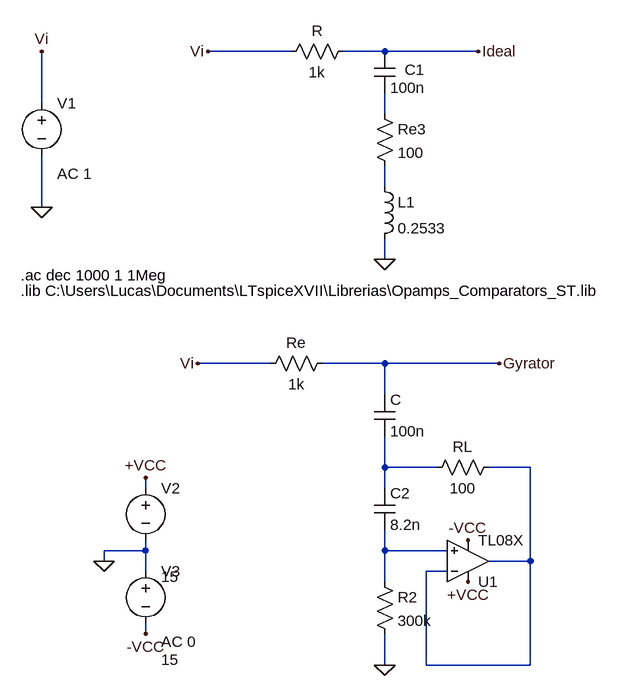
[diagram p0: schematic Rechazabanda.asc]
Rechazabanda.asc, the LTspice schematic file:
Version 4
SHEET 1 880 1108
WIRE 64 96 -64 96
WIRE 208 96 144 96
WIRE 352 96 208 96
WIRE -320 176 -320 96
WIRE 208 192 208 160
WIRE 208 304 208 272
WIRE -320 336 -320 256
WIRE 208 416 208 384
WIRE 32 576 -80 576
WIRE 208 576 112 576
WIRE 384 576 208 576
WIRE 208 624 208 576
WIRE 208 736 208 688
WIRE 288 736 208 736
WIRE 432 736 368 736
WIRE -160 768 -160 752
WIRE 208 768 208 736
WIRE -160 864 -160 848
WIRE -160 864 -224 864
WIRE 208 864 208 832
WIRE 304 864 208 864
WIRE -224 880 -224 864
WIRE 432 880 432 736
WIRE 432 880 368 880
WIRE -160 896 -160 864
WIRE 304 896 272 896
WIRE 208 912 208 864
WIRE -160 992 -160 976
WIRE 208 1040 208 992
WIRE 272 1040 272 896
WIRE 432 1040 432 880
WIRE 432 1040 272 1040
FLAG 208 416 0
FLAG 352 96 Ideal
FLAG -64 96 Vi
FLAG -320 96 Vi
FLAG -320 336 0
FLAG 208 1040 0
FLAG -80 576 Vi
FLAG 384 576 Gyrator
FLAG -224 880 0
FLAG -160 752 +VCC
FLAG -160 992 -VCC
FLAG 336 912 +VCC
FLAG 336 848 -VCC
SYMBOL res 160 80 R90
WINDOW 0 0 56 VBottom 2
WINDOW 3 32 56 VTop 2
SYMATTR InstName R
SYMATTR Value 1k
SYMBOL cap 192 96 R0
WINDOW 0 47 28 Left 2
SYMATTR InstName C1
SYMATTR Value 100n
SYMBOL res 192 176 R0
SYMATTR InstName Re3
SYMATTR Value 100
SYMBOL ind 192 288 R0
SYMATTR InstName L1
SYMATTR Value 0.2533
SYMBOL voltage -320 160 R0
WINDOW 123 24 124 Left 2
WINDOW 39 0 0 Left 0
SYMATTR Value2 AC 1
SYMATTR InstName V1
SYMATTR Value ""
SYMBOL res 128 560 R90
WINDOW 0 0 56 VBottom 2
WINDOW 3 32 56 VTop 2
SYMATTR InstName Re
SYMATTR Value 1k
SYMBOL cap 192 624 R0
SYMATTR InstName C
SYMATTR Value 100n
SYMBOL cap 192 768 R0
SYMATTR InstName C2
SYMATTR Value 8.2n
SYMBOL res 192 896 R0
SYMATTR InstName R2
SYMATTR Value 300k
SYMBOL Opamps\\opamp2 336 944 M180
SYMATTR InstName U1
SYMATTR Value TL08X
SYMBOL res 384 720 R90
WINDOW 0 0 56 VBottom 2
WINDOW 3 32 56 VTop 2
SYMATTR InstName RL
SYMATTR Value 100
SYMBOL voltage -160 752 R0
WINDOW 3 24 152 Left 2
WINDOW 123 24 124 Left 2
WINDOW 39 0 0 Left 0
SYMATTR Value 15
SYMATTR InstName V2
SYMBOL voltage -160 880 R0
WINDOW 3 24 152 Left 2
WINDOW 123 24 124 Left 2
WINDOW 39 0 0 Left 0
SYMATTR Value 15
SYMATTR Value2 AC 0
SYMATTR InstName V3
TEXT -352 440 Left 2 !.ac dec 1000 1 1Meg
TEXT -352 464 Left 2 !.lib C:\\Users\\Lucas\\Documents\\LTspiceXVII\\Librerias\\Opamps_Comparators_ST.lib

The netlist it stands for:
* Rechazabanda.asc
R Ideal Vi 1k
C1 Ideal N001 100n
Re3 N001 N002 100
L1 N002 0 0.2533
V1 Vi 0 AC 1
Re Gyrator Vi 1k
C Gyrator N003 100n
C2 N003 N005 8.2n
R2 N005 0 300k
XU1 N005 N004 +VCC -VCC N004 TL08X  ; pins In+ In- V+ V- OUT
RL N004 N003 100
V2 +VCC 0 15
V3 0 -VCC 15 AC 0
.ac dec 1000 1 1Meg
.lib C:\Users\Lucas\Documents\LTspiceXVII\Librerias\Opamps_Comparators_ST.lib
.backanno
.end